# EAGLE schematic Spectrophotometer (EAGLE 6.1)
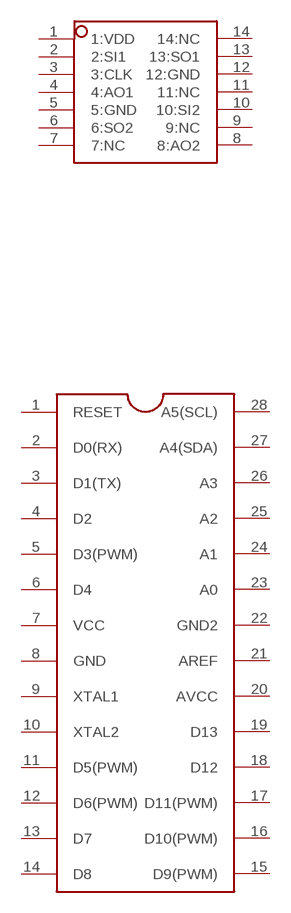
[diagram p0: schematic, sheet 1]

## Parts
U$1  ATMEGA168  [DIL28-3]
U$2  TSL1402R  [TSL1402R]
Unconnected: U$1.1(RESET) U$1.2(D0(RX)) U$1.3(D1(TX)) U$1.4(D2) U$1.5(D3(PWM)) U$1.6(D4) U$1.7(VCC) U$1.8(GND) U$1.9(XTAL1) U$1.10(XTAL2) U$1.11(D5(PWM)) U$1.12(D6(PWM)) U$1.13(D7) U$1.14(D8) U$1.15(D9(PWM)) U$1.16(D10(PWM)) U$1.17(D11(PWM)) U$1.18(D12) U$1.19(D13) U$1.20(AVCC) U$1.21(AREF) U$1.22(GND2) U$1.23(A0) U$1.24(A1) U$1.25(A2) U$1.26(A3) U$1.27(A4(SDA)) U$1.28(A5(SCL)) U$2.1(1:VDD) U$2.2(2:SI1) U$2.3(3:CLK) U$2.4(4:AO1) U$2.5(5:GND) U$2.6(6:SO2) U$2.7(7:NC) U$2.8(8:AO2) U$2.9(9:NC) U$2.10(10:SI2) U$2.11(11:NC) U$2.12(12:GND) U$2.13(13:SO1) U$2.14(14:NC)

## Library data of the parts
U$1 = 1dah:ATMEGA168
U$2 = 1dah:TSL1402R: 256 pixel linear photodiode array